# EAGLE design hrm-shield (EAGLE 7.1.0)
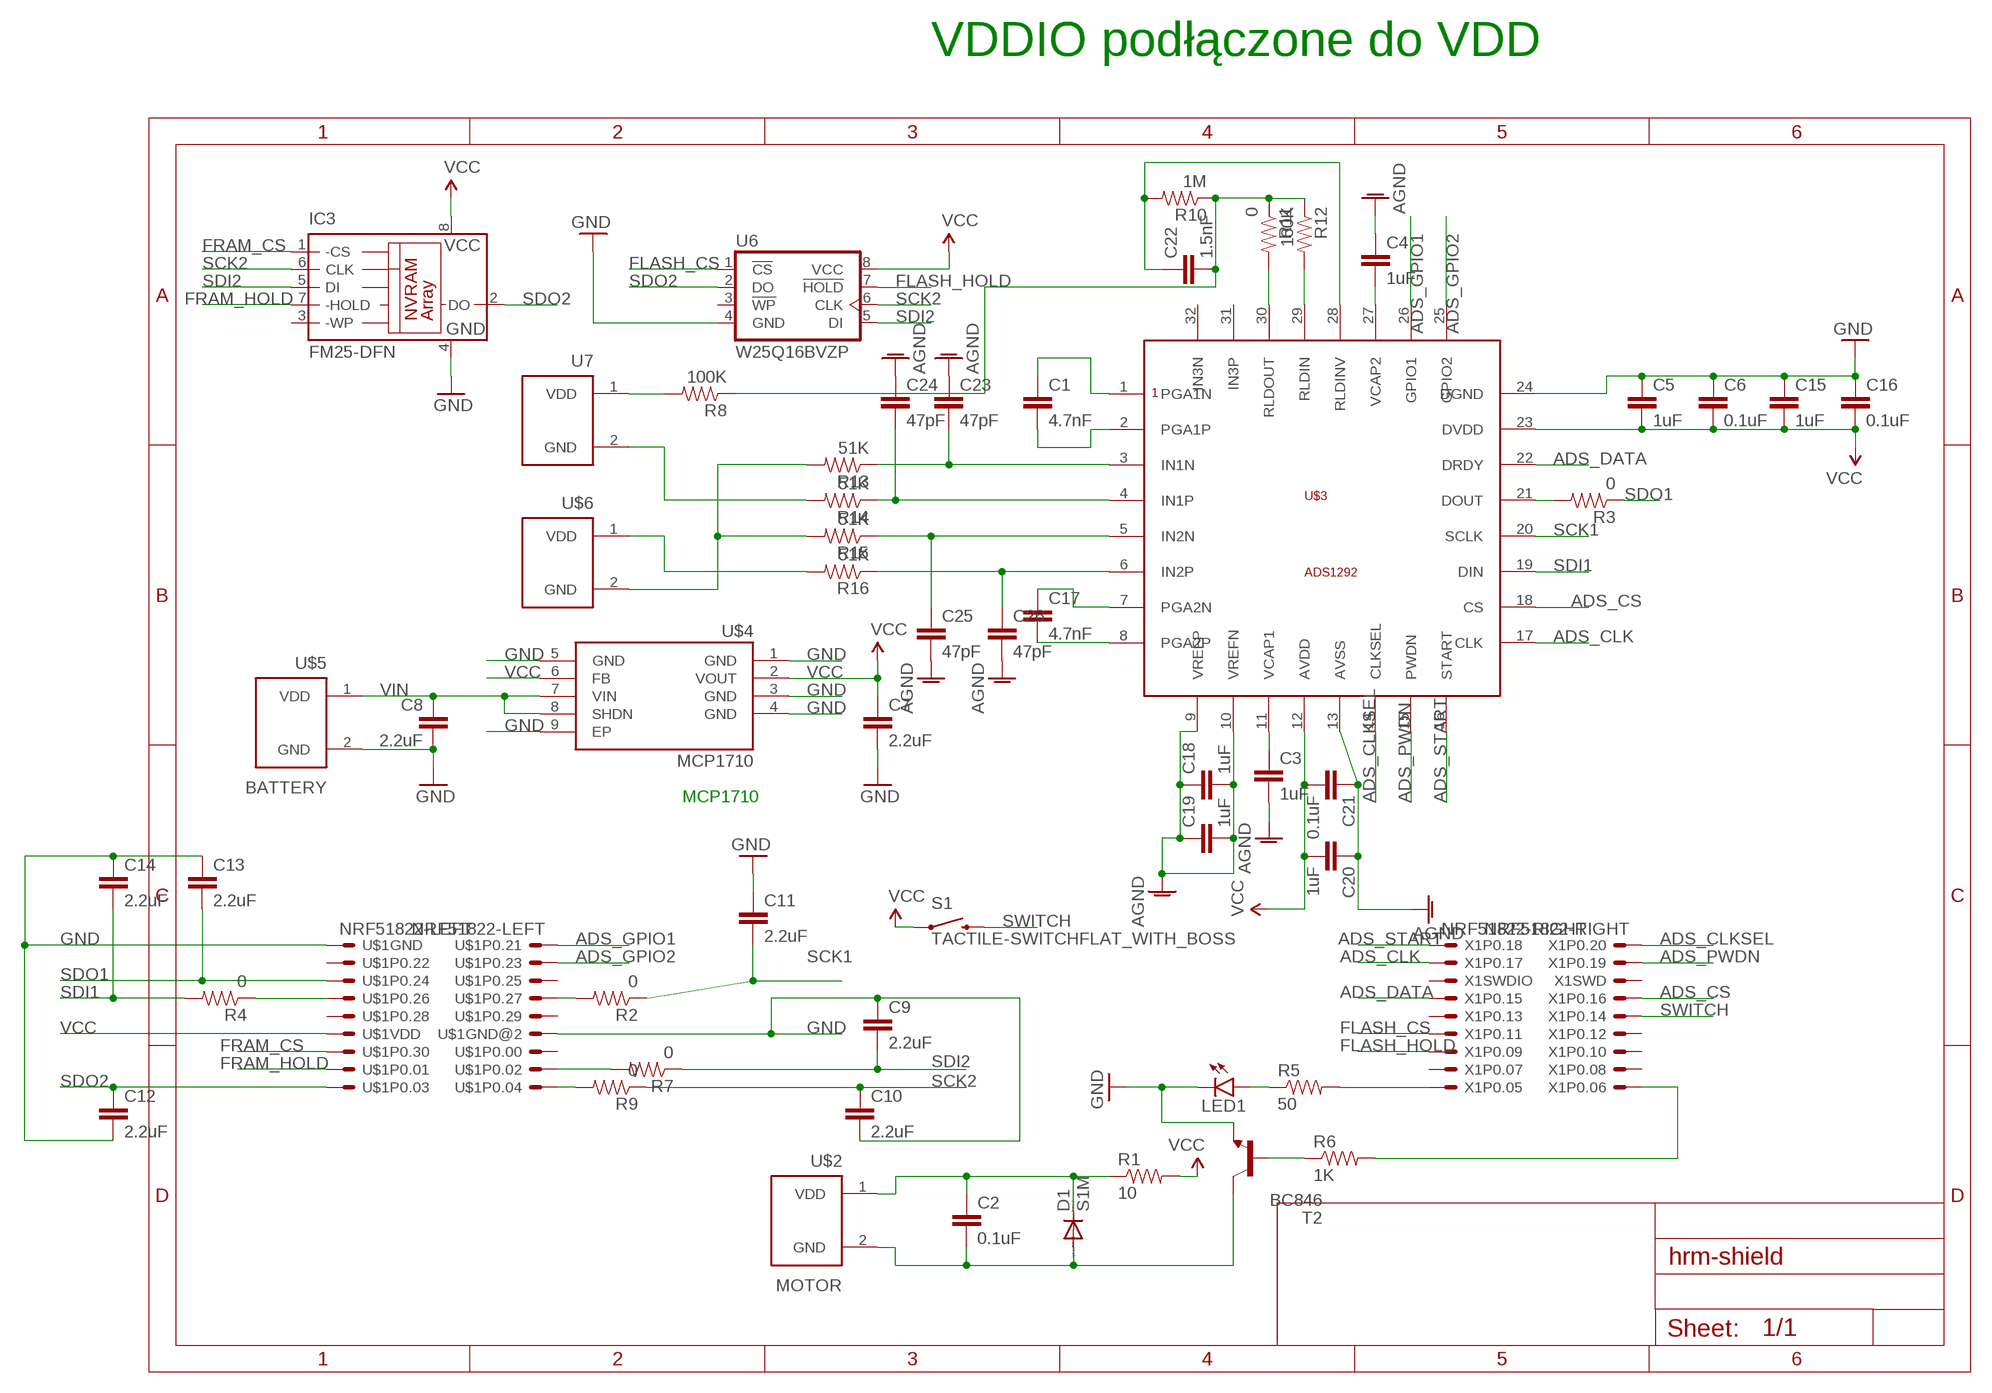
[diagram p0: schematic, sheet 1]

## Parts
C1  4.7nF  0.1UF-25V(+80/-20%)(0603)  [0603-CAP]
C2  0.1uF  0.1UF-25V(+80/-20%)(0603)  [0603-CAP]
C3  1uF  0.1UF-25V(+80/-20%)(0603)  [0603-CAP]
C4  1uF  0.1UF-25V(+80/-20%)(0603)  [0603-CAP]
C5  1uF  0.1UF-25V(+80/-20%)(0603)  [0603-CAP]
C6  0.1uF  0.1UF-25V(+80/-20%)(0603)  [0603-CAP]
C7  2.2uF  0.1UF-25V(+80/-20%)(0603)  [0603-CAP]
C8  2.2uF  0.1UF-25V(+80/-20%)(0603)  [0603-CAP]
C9  2.2uF  0.1UF-25V(+80/-20%)(0603)  [0603-CAP]
C10  2.2uF  0.1UF-25V(+80/-20%)(0603)  [0603-CAP]
C11  2.2uF  0.1UF-25V(+80/-20%)(0603)  [0603-CAP]
C12  2.2uF  0.1UF-25V(+80/-20%)(0603)  [0603-CAP]
C13  2.2uF  0.1UF-25V(+80/-20%)(0603)  [0603-CAP]
C14  2.2uF  0.1UF-25V(+80/-20%)(0603)  [0603-CAP]
C15  1uF  0.1UF-25V(+80/-20%)(0603)  [0603-CAP]
C16  0.1uF  0.1UF-25V(+80/-20%)(0603)  [0603-CAP]
C17  4.7nF  0.1UF-25V(+80/-20%)(0603)  [0603-CAP]
C18  1uF  0.1UF-25V(+80/-20%)(0603)  [0603-CAP]
C19  1uF  0.1UF-25V(+80/-20%)(0603)  [0603-CAP]
C20  1uF  0.1UF-25V(+80/-20%)(0603)  [0603-CAP]
C21  0.1uF  0.1UF-25V(+80/-20%)(0603)  [0603-CAP]
C22  1.5nF  0.1UF-25V(+80/-20%)(0603)  [0603-CAP]
C23  47pF  0.1UF-25V(+80/-20%)(0603)  [0603-CAP]
C24  47pF  0.1UF-25V(+80/-20%)(0603)  [0603-CAP]
C25  47pF  0.1UF-25V(+80/-20%)(0603)  [0603-CAP]
C26  47pF  0.1UF-25V(+80/-20%)(0603)  [0603-CAP]
D1  S1M  [SMA]
IC3  FM25-DFN  [DFN-8]
LED1  LED0603  [LED-0603]
R1  10  1KOHM1/10W1%(0603)  [0603-RES]
R2  0  100OHM1/10W1%(0603)  [0603-RES]
R3  0  100OHM1/10W1%(0603)  [0603-RES]
R4  0  100OHM1/10W1%(0603)  [0603-RES]
R5  50  100OHM1/10W1%(0603)  [0603-RES]
R6  1K  1KOHM1/10W1%(0603)  [0603-RES]
R7  0  100OHM1/10W1%(0603)  [0603-RES]
R8  100K  100OHM1/10W1%(0603)  [0603-RES]
R9  0  100OHM1/10W1%(0603)  [0603-RES]
R10  1M  100OHM1/10W1%(0603)  [0603-RES]
R11  0  100OHM1/10W1%(0603)  [0603-RES]
R12  100K  100OHM1/10W1%(0603)  [0603-RES]
R13  51K  100OHM1/10W1%(0603)  [0603-RES]
R14  51K  100OHM1/10W1%(0603)  [0603-RES]
R15  51K  100OHM1/10W1%(0603)  [0603-RES]
R16  51K  100OHM1/10W1%(0603)  [0603-RES]
S1  TACTILE-SWITCHFLAT_WITH_BOSS  [TACTILE-SWITCH-SMD]
T2  BC846  [SOT23]
U6  W25Q16BVZP  [WSON8]
U7  EM406-2PINFLAT  [EM406-2PIN]
U$1  NRF51822-LEFT  [NRF51822-LEFT]
U$2  MOTOR  EM406-2PINFLAT  [EM406-2PIN]
U$3  ADS1292  [QFN-32-4X4]
U$4  MCP1710  [MCP1710]
U$5  BATTERY  EM406-2PINFLAT  [EM406-2PIN]
U$6  EM406-2PINFLAT  [EM406-2PIN]
X1  NRF51822-RIGHT  [NRF51822-RIGHT]

## Nets
ADS_CLK: U$3.17(CLK) X1.3
ADS_CLKSEL: U$3.14(CLKSEL) X1.2
ADS_CS: U$3.18(CS) X1.8
ADS_DATA: U$3.22(DRDY) X1.7
ADS_GPIO1: U$1.2 U$3.26(GPIO1)
ADS_GPIO2: U$1.4 U$3.25(GPIO2)
ADS_PWDN: U$3.15(PWDN) X1.4
ADS_START: U$3.16(START) X1.1
AGND: C3.2 C4.1 C18.1 C18.2 C19.1 C19.2 C20.1 C21.1 C23.1 C24.1 C25.2 C26.2 U$3.9(VREFP) U$3.10(VREFN) U$3.13(AVSS)
FLASH_CS: U6.1(!CS!) X1.11
FLASH_HOLD: U6.7(!HOLD!) X1.13
FRAM_CS: IC3.1(-CS) U$1.13
FRAM_HOLD: IC3.7(-HOLD) U$1.15
GND: C5.1 C6.1 C7.2 C8.2 C9.1 C10.2 C11.1 C12.2 C13.1 C14.1 C15.1 C16.1 IC3.4(GND) LED1.C T2.2(E) U6.4(GND) U$1.1 U$1.12 U$3.24(DGND) U$4.1(GND) U$4.3(GND) U$4.4(GND) U$4.5(GND) U$4.9(EP) U$5.2(GND)
N$1: C4.2 U$3.27(VCAP2)
N$2: C2.1 D1.C R1.1 U$2.1(VDD)
N$3: R4.1 U$1.7
N$4: R2.2 U$1.8
N$5: R7.2 U$1.16
N$6: R5.2 X1.17
N$7: C3.1 U$3.11(VCAP1)
N$8: R9.2 U$1.18
N$9: C1.1 U$3.1(PGA1N)
N$10: C1.2 U$3.2(PGA1P)
N$11: R11.2 U$3.30(RLDOUT)
N$12: C17.2 U$3.8(PGA2P)
N$13: LED1.A R5.1
N$14: C2.2 D1.A T2.3(C) U$2.2(GND)
N$15: R6.2 X1.18
N$16: R6.1 T2.1(B)
N$17: R3.2 U$3.21(DOUT)
N$18: C17.1 U$3.7(PGA2N)
N$19: R12.2 U$3.29(RLDIN)
N$20: C22.2 R8.1 R10.1 R11.1 R12.1
N$21: C22.1 R10.2 U$3.28(RLDINV)
N$22: R8.2 U7.1(VDD)
N$23: C26.1 R16.1 U$3.6(IN2P)
N$24: C25.1 R15.1 U$3.5(IN2N)
N$25: C23.2 R13.1 U$3.3(IN1N)
N$26: C24.2 R14.1 U$3.4(IN1P)
N$27: R13.2 R15.2 U$6.2(GND)
N$28: R16.2 U$6.1(VDD)
N$29: R14.2 U7.2(GND)
SCK1: C11.2 R2.1 U$3.20(SCLK)
SCK2: C10.1 IC3.6(CLK) R9.1 U6.6(CLK)
SDI1: C14.2 R4.2 U$3.19(DIN)
SDI2: C9.2 IC3.5(DI) R7.1 U6.5(DI)
SDO1: C13.2 R3.1 U$1.5
SDO2: C12.1 IC3.2(DO) U6.2(DO) U$1.17
SWITCH: S1.2 X1.10
VCC: C5.2 C6.2 C7.1 C15.2 C16.2 C20.2 C21.2 IC3.8(VCC) R1.2 S1.1 U6.8(VCC) U$1.11 U$3.12(AVDD) U$3.23(DVDD) U$4.2(VOUT) U$4.6(FB)
VIN: C8.1 U$4.7(VIN) U$4.8(SHDN) U$5.1(VDD)
Unconnected: IC3.3(-WP) U6.3(!WP!) U$1.3 U$1.6 U$1.9 U$1.10 U$1.14 U$3.31(IN3P) U$3.32(IN3N) X1.5 X1.6 X1.9 X1.12 X1.14 X1.15 X1.16

## Notes on the sheet
- VDDIO podłączone do VDD
- MCP1710

## Library data of the parts
C1 C3-C5 C7-C15 C17-C20 C22-C26 = SparkFun-Capacitors:0.1UF-25V(+80/-20%)(0603): CAP-00810 Ceramic Standard decoupling cap; PROD_ID: CAP-00810; VALUE: 0.1uF
C2 C6 C16 C21 = SparkFun-Capacitors:0.1UF-25V(+80/-20%)(0603): CAP-00810 Ceramic Standard decoupling cap; PROD_ID: CAP-00810
D1 = icarus_sensors:S1M
IC3 = icarus_sensors:FM25*: SPI Serial NVRAM
LED1 = SparkFun-LED:LED: LEDs Standard schematic elements and footprints for 5mm, 3mm, 1206, and 0603 sized LEDs. 5mm - Spark Fun Electronics SKU : COM-00529 (and others)
R1 = SparkFun-Resistors:1KOHM1/10W1%(0603): RES-07856; PROD_ID: RES-07856; VALUE: 1K
R2-R5 R7-R16 = SparkFun-Resistors:100OHM1/10W1%(0603): RES-07863; PROD_ID: RES-07863; VALUE: 100
R6 = SparkFun-Resistors:1KOHM1/10W1%(0603): RES-07856; PROD_ID: RES-07856
S1 = icarus_sensors:TACTILE-SWITCH: OMRON B3U-3000P(M)-B momentary switch
T2 = icarus_sensors:BC846: NPN TRANSISTOR
U6 = icarus_sensors:W25Q16BV: EEPROM 4 Mbit SPI Serial Flash7
U7 U$2 U$5 U$6 = icarus_sensors:EM406-2PIN
U$1 = NRF51822_con_left:NRF51822-LEFT: left connector of NFR518822 board; MPN: NRF51822-left; OC_FARNELL: unknown; OC_NEWARK: 25M5675
U$3 = icarus_sensors:ADS1292: TEXAS INSTRUMENTS ADS1292
U$4 = icarus_sensors:MCP1710: MCP1710 Ultra-Low Quiescent Current LDO Regulator 2x2mm
X1 = NRF51822_con_left:NRF51822-RIGHT: right connector of NFR518822 board; MPN: NRF51822-right; OC_FARNELL: unknown; OC_NEWARK: 25M5675

## Board
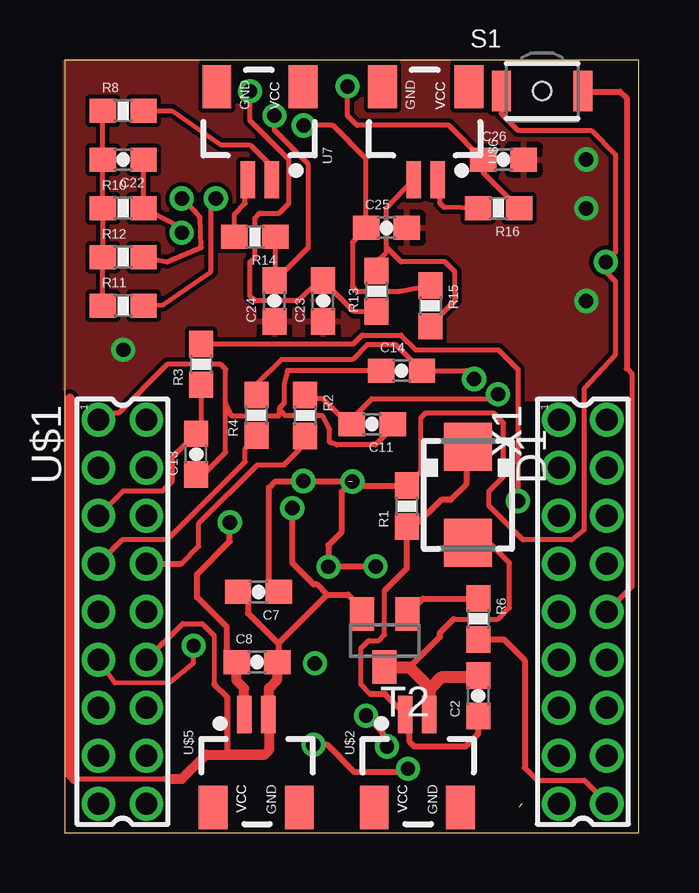
[diagram p1: board, top side]
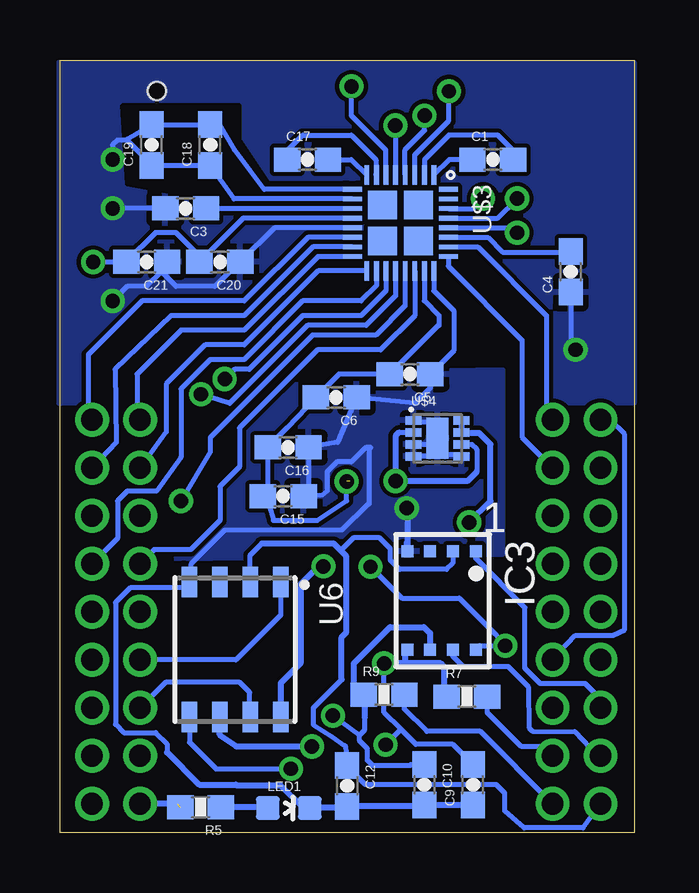
[diagram p2: board, bottom side, seen from below]

Size 23.94 x 32.19 mm. Coordinates in mm from the lower left corner, seen from the top.
Outline: 0,0 23.94,0 23.94,32.19 0,32.19 0,0
Copper layers (1*16): Top 0.035mm / dielectric 1.5mm / Bottom 0.035mm
Design rules "default *": minimum track width 8mil, minimum drill 4mil, track to track 7mil, track to pad 7mil, pad to pad 7mil, via to via 7mil, smd to smd 7mil, copper to edge 0mil, drill to drill 8mil, minimum pad ring 10mil, minimum via ring 8mil, stop-mask expansion 4mil, vias tented up to drill 0mil, thermal gap 10mil

### Footprints (pad centres in the part's own frame; a part is rotated, then mirrored left to right if it is on the bottom)
0603-CAP = smd 1.1 x 1: 1 -0.85,0; 2 0.85,0
SMA = smd 2 x 2: A 2,0; C -2,0
DFN-8 = smd 0.5 x 0.5: 1 -1.425,-2.05; 2 -0.475,-2.05; 3 0.475,-2.05; 4 1.425,-2.05; 5 1.425,2.05; 6 0.475,2.05; 7 -0.475,2.05; 8 -1.425,2.05
LED-0603 = smd 1 x 1: A 0,-0.877; C 0,0.877
0603-RES = smd 1.1 x 1: 1 -0.85,0; 2 0.85,0
TACTILE-SWITCH-SMD = smd 0.8 x 1.7: 1 -1.7,0; 2 1.7,0 | hole 0.75: 0,0
SOT23 = smd 1 x 1.4: 1 -0.95,-1.1; 2 0.95,-1.1; 3 0,1.1
WSON8 = smd 0.635 x 1.27: 1 -1.905,-2.81; 2 -0.635,-2.81; 3 0.635,-2.81; 4 1.905,-2.81; 5 1.905,2.81; 6 0.635,2.81; 7 -0.635,2.81; 8 -1.905,2.81
EM406-2PIN = smd 0.6 x 1.55: 1 -2.54,2.92; 2 -1.54,2.92 | smd 1.2 x 1.8: P$1 -3.84,-0.955; P$2 -0.24,-0.955
NRF51822-LEFT = drill 0.9 pad 1.27: 1 -8,-1; 2 -8,1; 3 -6,-1; 4 -6,1; 5 -4,-1; 6 -4,1; 7 -2,-1; 8 -2,1; 9 0,-1; 10 0,1; 11 2,-1; 12 2,1; 13 4,-1; 14 4,1; 15 6,-1; 16 6,1; 17 8,-1; 18 8,1
QFN-32-4X4 = smd 0.8 x 0.2: 1 -2,-0.6; 2 -2,-1; 3 -2,-1.4; 4 -2,-1.8; 5 -2,-2.2; 6 -2,-2.6; 7 -2,-3; 8 -2,-3.4; 17 2,-3.4; 18 2,-3; 19 2,-2.6; 20 2,-2.2; 21 2,-1.8; 22 2,-1.4; 23 2,-1; 24 2,-0.6 | smd 0.2 x 0.8: 9 -1.4,-4; 10 -1,-4; 11 -0.6,-4; 12 -0.2,-4; 13 0.2,-4; 14 0.6,-4; 15 1,-4; 16 1.4,-4; 25 1.4,0; 26 1,0; 27 0.6,0; 28 0.2,0; 29 -0.2,0; 30 -0.6,0; 31 -1,0; 32 -1.4,0 | smd 1.2 x 1.2: P$33 0.75,-1.25; P$34 -0.75,-1.25; P$35 0.75,-2.75; P$36 -0.75,-2.75
MCP1710 = smd 0.35 x 0.65: 1 0,-2; 2 0.5,-2; 3 1,-2; 4 1.5,-2; 5 1.5,0; 6 1,0; 7 0.5,0; 8 0,0 | smd 1.7 x 0.9: 9 0.75,-1
NRF51822-RIGHT = drill 0.9 pad 1.27: 1 -8,-1; 2 -8,1; 3 -6,-1; 4 -6,1; 5 -4,-1; 6 -4,1; 7 -2,-1; 8 -2,1; 9 0,-1; 10 0,1; 11 2,-1; 12 2,1; 13 4,-1; 14 4,1; 15 6,-1; 16 6,1; 17 8,-1; 18 8,1

### Placement (x,y rotation side)
C1  5.89,28.04 0 bottom
C2  17.24,5.7 90 top
C3  18.69,26.01 180 bottom
C4  2.64,23.37 90 bottom
C5  9.35,19.1 180 bottom
C6  12.42,18.14 180 bottom
C7  8.07,10.03 180 top
C8  8.02,7.1 0 top
C9  6.72,1.99 90 bottom
C10  8.75,1.99 270 bottom
C11  12.81,17.02 180 top
C12  11.96,1.94 270 bottom
C13  5.48,15.77 90 top
C14  14.04,19.24 0 top
C15  14.63,14.02 180 bottom
C16  14.43,16.05 180 bottom
C17  13.61,28.04 0 bottom
C18  17.68,28.65 90 bottom
C19  20.12,28.65 90 bottom
C20  17.27,23.77 180 bottom
C21  20.32,23.77 180 bottom
C22  2.44,28.04 180 top
C23  10.77,22.15 90 top
C24  8.74,22.15 90 top
C25  13.41,25.2 0 top
C26  18.29,28.04 0 top
D1  16.81,14.07 270 top
IC3  8.03,9.67 180 bottom
LED1  14.4,1.02 270 bottom
R1  14.26,13.6 90 top
R2  10.02,17.38 270 top
R3  5.69,19.51 90 top
R4  7.99,17.39 90 top
R5  18.07,1.06 180 bottom
R6  17.24,8.9 270 top
R7  6.97,5.67 0 bottom
R8  2.44,30.07 0 top
R9  10.43,5.75 0 bottom
R10  2.44,26.01 0 top
R11  2.44,21.95 0 top
R12  2.44,23.98 0 top
R13  13,22.56 90 top
R14  7.92,24.82 180 top
R15  15.24,21.95 270 top
R16  18.08,26.01 180 top
S1  19.9,30.9 0 top
T2  13.34,8 180 top
U6  16.64,7.62 180 bottom
U7  6.1,30.12 180 top
U$1  2.4,9.2 270 top
U$2  16.74,2 0 top
U$3  7.75,25.4 270 bottom
U$4  7.2,17.18 270 bottom
U$5  10.02,2 0 top
U$6  13,30.12 180 top
X1  21.6,9.2 270 top

### Tracks (layer width: path | path; a pad name or v marks a point on that pad's centre or on a via)
ADS_CLK
  Bottom 0.203: U$3.17 13.18,23.4 16.26,20.32 17.88,20.32 19.51,18.69 19.51,16.7 X1.3
ADS_CLKSEL
  Bottom 0.203: U$3.14 13.61,24.8 16.26,22.15 20.52,22.15 22.76,19.91 22.76,17.36 X1.2
ADS_CS
  Bottom 0.203: U$3.18 10.75,22.78 11.38,22.15 13.82,22.15 16.26,19.71 17.68,19.71 18.9,18.49 18.9,15.65 19.91,14.22 21.13,14.22 21.54,13.82 21.54,12.26 X1.8
ADS_DATA
  Bottom 0.203: U$3.22 9.15,21.54 10.57,20.12 13.21,20.12 16.46,16.87 16.46,15.24 17.27,14.43 17.27,13.01 18.49,11.79 20.01,11.79 X1.7
ADS_GPIO1
  Bottom 0.203: U$3.26 6.52,24.4 3.66,21.54 3.66,17.46 U$1.2
ADS_GPIO2
  Bottom 0.203: U$3.25 7.75,23.6 4.67,20.52 4.67,16.47 U$1.4
ADS_PWDN
  Bottom 0.203: U$3.15 13.39,24.4 16.26,21.54 19.3,21.54 21.64,19.3 21.59,16.26 X1.4
ADS_START
  Bottom 0.203: U$3.16 13.19,24 16.26,20.93 18.9,20.93 20.73,19.1 20.73,17.33 X1.1
AGND  (via drill 0.6)
  Bottom 0.203: U$3.13 15,25.2 C20.1 16.46,23.77 17.48,22.76 19.1,22.76 19.71,23.37 | U$3.9 15.42,26.8 16.05,27.64 16.66,28.45 17.27,29.46 17.64,29.87 C18.2 C19.2 21.13,28.89 21.13,28.85 | U$3.10 16.68,26.4 C18.1 C19.1 20.49,28.21 21.13,28.85 | 21.13,28.85 21.54,28.85 21.74,28.65 v21.74,28.04 | C3.2 v21.74,26.01 | C4.1 2.64,20.32 v2.44,20.12 | 19.71,23.37 20.32,22.76 21.13,22.76 v21.74,22.15 | C21.1 19.47,23.61 19.71,23.37
  pour Top: 0,32.11 0,18.08 23.98,18.08 23.98,19.1 23.98,32.11
  pour Bottom: 0,17.88 23.98,17.88 23.98,19.71 23.98,32.11 0,32.11
FLASH_CS
  Bottom 0.203: U6.1 14.74,9.06 16.6,7.2 X1.11
FLASH_HOLD
  Bottom 0.203: U6.7 16.03,4.84 16.03,5.84 16.45,6.25 19.54,6.25 X1.13
FRAM_CS
  Bottom 0.203: U$1.13 1.4,5.57 2.05,6.21 3.93,6.21 4.57,6.86 4.55,6.88 4.55,9.38 6.61,11.43 IC3.1
FRAM_HOLD
  Bottom 0.203: U$1.15 1.53,3.2 2.48,4.21 4.24,4.23 4.36,4.35 4.39,6.05 5.25,6.91 7.11,6.91 7.56,7.35 IC3.7
GND  (via drill 0.6)
  Top 0.203: U$1.12 4.91,8.71 5.71,8.71 6.23,8.2 6.23,6.18 | C14.1 9.29,19.24 9.14,18.69 9.14,17.88 8.94,17.68 | 8.94,17.68 8.91,17.35 6.96,17.35 6.71,17.88 | 6.71,17.88 6.71,19.3 6.5,19.51 4.27,19.51 2.23,17.48 1.68,17.48 U$1.1 | C13.1 5.7,14.84 6.71,15.85 6.71,17.88 | C11.1 13.66,16.87 12.95,16.16 11.35,16.16 11.04,16.26 11.04,16.8 10.74,17.37 9.2,17.37 8.94,17.68
  Top 0.254: C8.2 9.02,7.25 8.93,7.34 8.93,7.85 | 12.39,9.22 T2.2 12.39,9.33 11.81,9.91 10.94,9.91 | 8.93,7.85 8.93,7.9 10.94,9.91 | C7.2 7.64,9.61 7.64,9.13 8.93,7.85 | 10.94,9.91 10.51,10.34 10.37,10.34 9.48,11.23 v9.48,13.52 | U$5.2 8.48,3.4 8.39,3.31 8.39,3.32 6.9,3.32 6.78,3.44 6.78,5.63 6.23,6.18
  Top 0.406: U$5.2 8.51,4.95 8.51,6.02 8.87,6.38 C8.2
  Bottom 0.203: U$1.12 2.44,8.21 0.9,8.21 0.39,8.46 0.39,16.59 1.01,17.2 U$1.1 | 19.47,3.34 19.47,3.69 19.95,4.16 21.27,4.16 21.62,4.51 21.62,9.59 21.01,10.2 18.78,10.2 U6.4 18.49,10.49 18.49,11.18 17.07,12.6 12.19,12.6 11.11,13.69 11.04,13.69 11.04,15.98 10.97,16.05 11.18,16.05 11.79,15.44 12.39,15.44 12.8,15.04 12.8,14.22 13.01,14.06 C15.1 13.58,14.22 C16.1 12.36,16.26 C6.1 9.14,17.88 8.5,18.53 C5.1 7.52,20.08 7.52,21.74 8.35,22.57 U$3.24 | U$4.5 7.27,15.75 7.88,15.75 8.2,16.07 U$4.9 | U$4.3 8.2,16.18 U$4.9 | U$4.9 8.2,16.87 8.45,17.11 9.14,17.11 U$4.1 9.22,17.2 | U$4.4 9.18,15.7 8.53,15.7 8.2,16.03 U$4.9
  Bottom 0.254: C9.1 6.75,1.11 6.78,1.14 C10.2 8.8,1.09 C12.2 12.11,1.02 LED1.C 13.8,1.02 14.76,1.98 16.59,1.98 16.6,2 18.13,2 19.47,3.34 | 9.46,12.11 IC3.4 9.46,13.49 v9.48,13.52
  pour Bottom: 5.49,19.3 5.49,11.58 19.1,11.38 16.46,19.1
N$1
  Bottom 0.203: U$3.27 6.11,24.8 5.49,24.18 2.68,24.18 C4.2
N$2
  Top 0.203: 12.75,5.77 12.35,6.17 12.35,7.67 12.67,7.99 13.09,7.99 13.34,8.24 13.34,10.08
  Top 0.254: U$2.1 | C2.1 17.24,4.12 16.7,3.58 14.58,3.58 14.38,3.79 14.38,4.34 14.2,4.52 U$2.1 | U$2.1 13.35,5.77 12.75,5.77 | D1.C 16.74,16 16.74,14.52 16.08,13.86 15.7,13.86 14.59,12.75 R1.1 14.26,11.01 13.34,10.08
N$3
  Top 0.203: U$1.7 2.42,12.22 4.29,12.22 7.52,15.44 7.52,15.99 R4.1
N$4
  Top 0.203: 4.86,11.2 5.59,11.93 5.59,12.88 8.03,15.32 9.14,15.32 9.77,15.94 9.77,16.11
  Top 0.254: U$1.8 4.86,11.2 | 9.77,16.11 R2.2
N$5
  Bottom 0.203: U$1.16 3.78,3.58 4.69,3.58 6.12,5 R7.2
N$6  (1 unrouted)
  Bottom 0.254: 19.06,1.2 X1.17
N$7
  Bottom 0.203: U$3.11 17.45,26 C3.1
N$8
  Bottom 0.203: U$1.18 6.41,4.21 8.65,4.21 9.58,5.14 R9.2
N$9
  Bottom 0.203: C1.1 7.71,28.04 U$3.1
N$10
  Bottom 0.203: C1.2 5.08,28.04 5.08,28.45 5.69,29.06 7.72,29.06 8.74,28.04 8.74,27.41 U$3.2
N$11  (via drill 0.6)
  Top 0.203: R11.2 4.1,21.98 6.1,23.37 6.1,26.21 v6.3,26.42
  Bottom 0.203: U$3.30 6.71,26 v6.3,26.42
N$12
  Bottom 0.203: C17.2 11.79,28.04 U$3.8
N$13
  Bottom 0.203: 17.22,1.15 R5.1
  Bottom 0.254: LED1.A 15.31,1.06 R5.1
N$14
  Top 0.203: 16.21,8.89 18.08,8.89 18.54,9.36 18.54,11.24 17.71,12.07 D1.A
  Top 0.254: 14.38,6.88 15.65,8.15 15.65,8.33 16.21,8.89
  Top 0.508: T2.3 13.35,6.88 14.38,6.88 15.2,6.06 | 15.2,6.06 U$2.2 | C2.2 17.15,6.46 15.68,6.46 15.28,6.06 15.2,6.06
N$15
  Top 0.203: 19.18,2.71 19.7,2.18 21.65,2.18 22.6,1.24 X1.18
  Top 0.254: R6.2 18.3,8.05 19.18,7.18 19.18,2.71
N$16
  Top 0.254: T2.1 14.94,9.75 R6.1
N$17  (via drill 0.6)
  Top 0.203: v18.9,13.82 18.9,19.3 18.09,20.12 14.63,20.12 14.02,20.73 12.39,20.73 12.03,20.36 R3.2
  Bottom 0.203: U$3.21 9.55,21.95 10.77,20.73 13.41,20.73 17.68,16.46 17.68,15.85 v18.9,13.82
N$18
  Bottom 0.203: C17.1 14.46,28.41 13.82,29.06 11.79,29.06 10.77,28.04 10.77,27.42 U$3.7
N$19  (via drill 0.6)
  Top 0.203: R12.2 4.27,23.77 5.69,24.38 5.64,25.65 5.49,25.8 v4.88,26.42
  Bottom 0.203: U$3.29 5.69,25.6 v4.88,26.42
N$20
  Top 0.203: R11.1 R12.1 R10.1 C22.2 R8.1
N$21  (via drill 0.6)
  Top 0.203: v4.88,24.99 4.47,25.4 R10.2 C22.1
  Bottom 0.203: U$3.28 5.08,25.2 v4.88,24.99
N$22
  Top 0.203: R8.2 4.47,30.07 6.5,28.65 7.72,28.65 8.74,27.64 8.74,27.25 U7.1
N$23  (via drill 0.6)
  Top 0.203: v11.79,31.09 11.79,29.87 12.19,29.46 16.02,29.46 C26.1 17.44,27.51 R16.1
  Bottom 0.203: U$3.6 10.35,28.43 11.79,29.87 v11.79,31.09
N$24  (via drill 0.6)
  Top 0.203: v9.96,29.46 11.18,29.46 12.56,28.08 C25.1 12.56,25.16 11.99,24.59 11.99,22.76 12.19,22.55 13.98,22.55 R15.1
  Bottom 0.203: v9.96,29.46 9.95,29.45 U$3.5
N$25  (via drill 0.6)
  Top 0.203: v7.72,30.89 7.72,29.67 9.35,28.04 9.35,26.21 8.94,25.81 8.13,25.81 7.92,25.6 7.92,23.98 7.72,23.77 7.72,22.35 7.92,22.15 9.75,22.15 10.6,23 C23.2 12.06,21.7 R13.1
  Bottom 0.203: U$3.3 9.15,28.24 7.72,29.67 v7.72,30.89
N$26  (via drill 0.6)
  Top 0.203: v8.74,29.87 8.74,29.26 10.16,27.84 10.16,24.38 8.78,23 C24.2 8.78,23.04 R14.1 8.74,24.55
  Bottom 0.203: U$3.4 9.55,28.45 8.74,29.26 v8.74,29.87
N$27
  Top 0.203: 13.01,23.37 R13.2 13.01,23.77 13.41,24.18 13.41,24.38 | 13.41,24.38 13.41,26.02 U$6.2 | R15.2 15.24,21.13 16.26,22.15 16.26,23.37 15.85,23.77 14.02,23.77 13.41,24.38
N$28
  Top 0.203: R16.2 15.81,26.05 15.65,26.21 15.65,27.05 U$6.1
N$29
  Top 0.203: 7.68,27.11 U7.2 7.52,27.04 7.52,26.21 7.08,25.77 R14.2
N$30
  Top 0.203: 0.38,2.23 4.29,2.23
  Top 0.406: 0.2,18.09 0.2,2.44 0.38,2.23 | 4.29,2.23 4.88,2.23 5.89,3.25 8.33,3.25 8.53,3.45 8.53,4.47
N$31
  cutout Bottom: 11.18,27.03 15.24,27.03 16.46,28.85 16.46,30.28 21.34,30.28 21.13,27.03 15.44,26.01 11.18,26.21
SCK1  (via drill 0.6)
  Top 0.203: C11.2 11.96,17.25 | 11.96,17.25 12.8,18.09 17.88,18.09 v18.06,18.26 | 11.96,17.25 11.61,17.25 10.77,18.09 10.14,18.09 R2.1
  Bottom 0.203: U$3.20 9.95,22.36 11.18,21.13 13.61,21.13 16.87,17.88 v18.06,18.26
SCK2  (via drill 0.6)
  Top 0.254: v12.56,4.87 13.23,4.2 v13.43,3.59
  Bottom 0.203: R9.1 11.25,5.72 11.25,4.26 11.45,4.06 | 11.45,4.06 v12.56,4.87 | C10.1 9.29,2.84 9.34,2.79 10.89,2.79 11.12,3.01 11.12,3.49 11.45,3.82 11.45,4.06
  Bottom 0.254: R9.1 11.24,5.71 11.24,4.79 | R9.1 | R9.1 11.7,6.17 11.7,7.04 10.18,8.56 8.76,8.56 8.51,8.31 IC3.6 | v13.43,3.59 16.58,3.59 17.27,4.08 U6.6
SDI1  (via drill 0.6)
  Top 0.203: v17.07,18.9 16.72,19.24 C14.2 13.81,20.32 12.6,20.32 11.99,19.71 9.03,19.71 8.01,18.69 R4.2
  Bottom 0.203: U$3.19 10.35,22.57 11.38,21.54 13.82,21.54 16.05,19.3 16.66,19.3 v17.07,18.9
SDI2  (via drill 0.6)
  Top 0.254: 10.37,3.65 v10.36,3.66 10.95,3.66 12.09,2.52 14.17,2.52 v14.31,2.66
  Bottom 0.203: C9.2 7.55,3.68 9.11,3.68 9.72,4.3 | 9.72,4.3 10.43,5 10.43,6.59 10.43,6.6 v10.43,7.05 | U6.5 18.53,4.8 18.53,3.76 17.43,2.66 v14.31,2.66 | v10.36,3.66 9.72,4.3
  Bottom 0.254: R7.1 7.9,5.75 7.9,6.9 8.06,7.05 9.55,7.05 | 9.55,7.05 v10.43,7.05 | IC3.5 9.55,7.52 9.55,7.05
SDO1
  Top 0.203: R3.1 5.69,16.75 C13.2 5.36,16.54 4.47,15.65 4.47,14.63 4.06,14.22 2.42,14.22 U$1.5
SDO2
  Bottom 0.203: U$1.17 2.13,0.19 4.59,0.19 5.39,0.89 5.39,1.65 5.74,2 11.2,2 12,2.79 C12.1 | U6.2 16.01,10.44 16.01,11.56 15.53,12.04 | C12.1 12.04,3 | 12.2,6.38 13.39,5.18 13.39,4.5 12.59,3.98 12.07,3.62 12.06,3.62 12.04,3.6 C12.1 | IC3.2 7.56,11.22 7.82,10.96 9.77,10.96 10.16,11.35 10.16,11.83 10.61,12.28 11.71,12.28 12.21,11.78 12.21,11.73
  Bottom 0.254: 12.2,6.38 12.2,8.15 11.99,8.35 11.99,11.51 12.21,11.73 12.52,12.04 15.53,12.04
SWITCH
  Top 0.203: 23.43,19.34 23.65,19.13 23.65,10.25 X1.10
  Top 0.254: S1.2 21.63,30.87 23.15,30.87 23.43,30.59 23.43,19.34
VCC  (via drill 0.6)  (1 unrouted)
  Top 0.203: U$1.11 2.08,6.24 4.37,6.26 5.37,7.08 v5.37,7.79 | S1.1 18.2,29.96 18.9,29.26 21.95,29.26 22.96,28.25 22.96,24.18 v22.55,23.77 22.55,23.37 22.96,22.96 22.96,19.91 21.64,18.49 21.64,12.6 21.13,12.19 19.1,12.19 17.68,13.61 17.68,14.22 18.29,14.83 18.29,17.07 17.88,17.48 15.04,17.48 14.83,17.27 14.83,15.02 R1.2
  Top 0.254: v12.95,11.09 v12.96,11.09 10.89,11.09 10.9,11.08 v10.99,11.08 | 11.84,14.63 12.01,14.45 R1.2 | 10.99,10.99 v10.99,11.08 | 10.94,11.08 v10.99,11.08 | v10.99,11.08 10.99,11.98 11.55,12.54 11.55,14.21 11.84,14.5 11.84,14.63 | 9.08,9.87 C7.1 8.51,10.44 8.51,14.37 8.77,14.63 9.95,14.63 | 9.95,14.63 11.84,14.63 | v9.94,14.65 9.94,14.63 9.95,14.63
  Bottom 0.203: v10.99,11.08 9.68,9.77 7.29,9.77 5.81,8.29 v5.37,7.79 6.44,7.79 IC3.8 | U$4.6 | U$4.6 6.75,16.18 6.56,15.98 6.57,15.97 6.56,15.97 6.56,15.04 | 9.8,16.68 U$4.2 | 8.72,23.59 U$3.23 8.75,22.16 8.13,21.54 8.13,21.13 8.16,21.13 C5.2 12.3,19.1 C6.2 14.46,16.87 C16.2 15.28,14.22 | 15.28,14.22 C15.2 | 15.28,14.22 15.28,13.86 15.04,13.01 13.21,13.01 11.99,13.82 v11.99,14.63 | U$3.12 16.3,25.6 C20.2 18.12,24.02 19.1,24.99 19.95,24.99 C21.2 v22.55,23.77
  Bottom 0.254: U6.8 14.73,4.82 14.73,6.24 13.89,7.08 13.89,10.36 13.16,11.09 v12.96,11.09 | 6.56,15.04 6.96,14.65 v9.94,14.65 9.94,16.53 9.8,16.68
VIN  (via drill 0.6)
  Top 0.254: 7.02,7.25 C8.1 6.76,7.51 6.76,8.55 5.51,9.8 5.51,10.76 6.88,12.13 v6.88,12.92
  Top 0.406: U$5.1 7.48,6.01 7.17,6.32 C8.1
  Bottom 0.254: U$4.8 U$4.7 7.17,16.65 6.47,16.65 5.99,16.18 5.99,13.81 v6.88,12.92